# Altium schematic sheet [09] - AFE.SchDoc (part 1 of 3)
size A3; DocumentNumber: 10; SheetNumber: 10; SheetTotal: 12
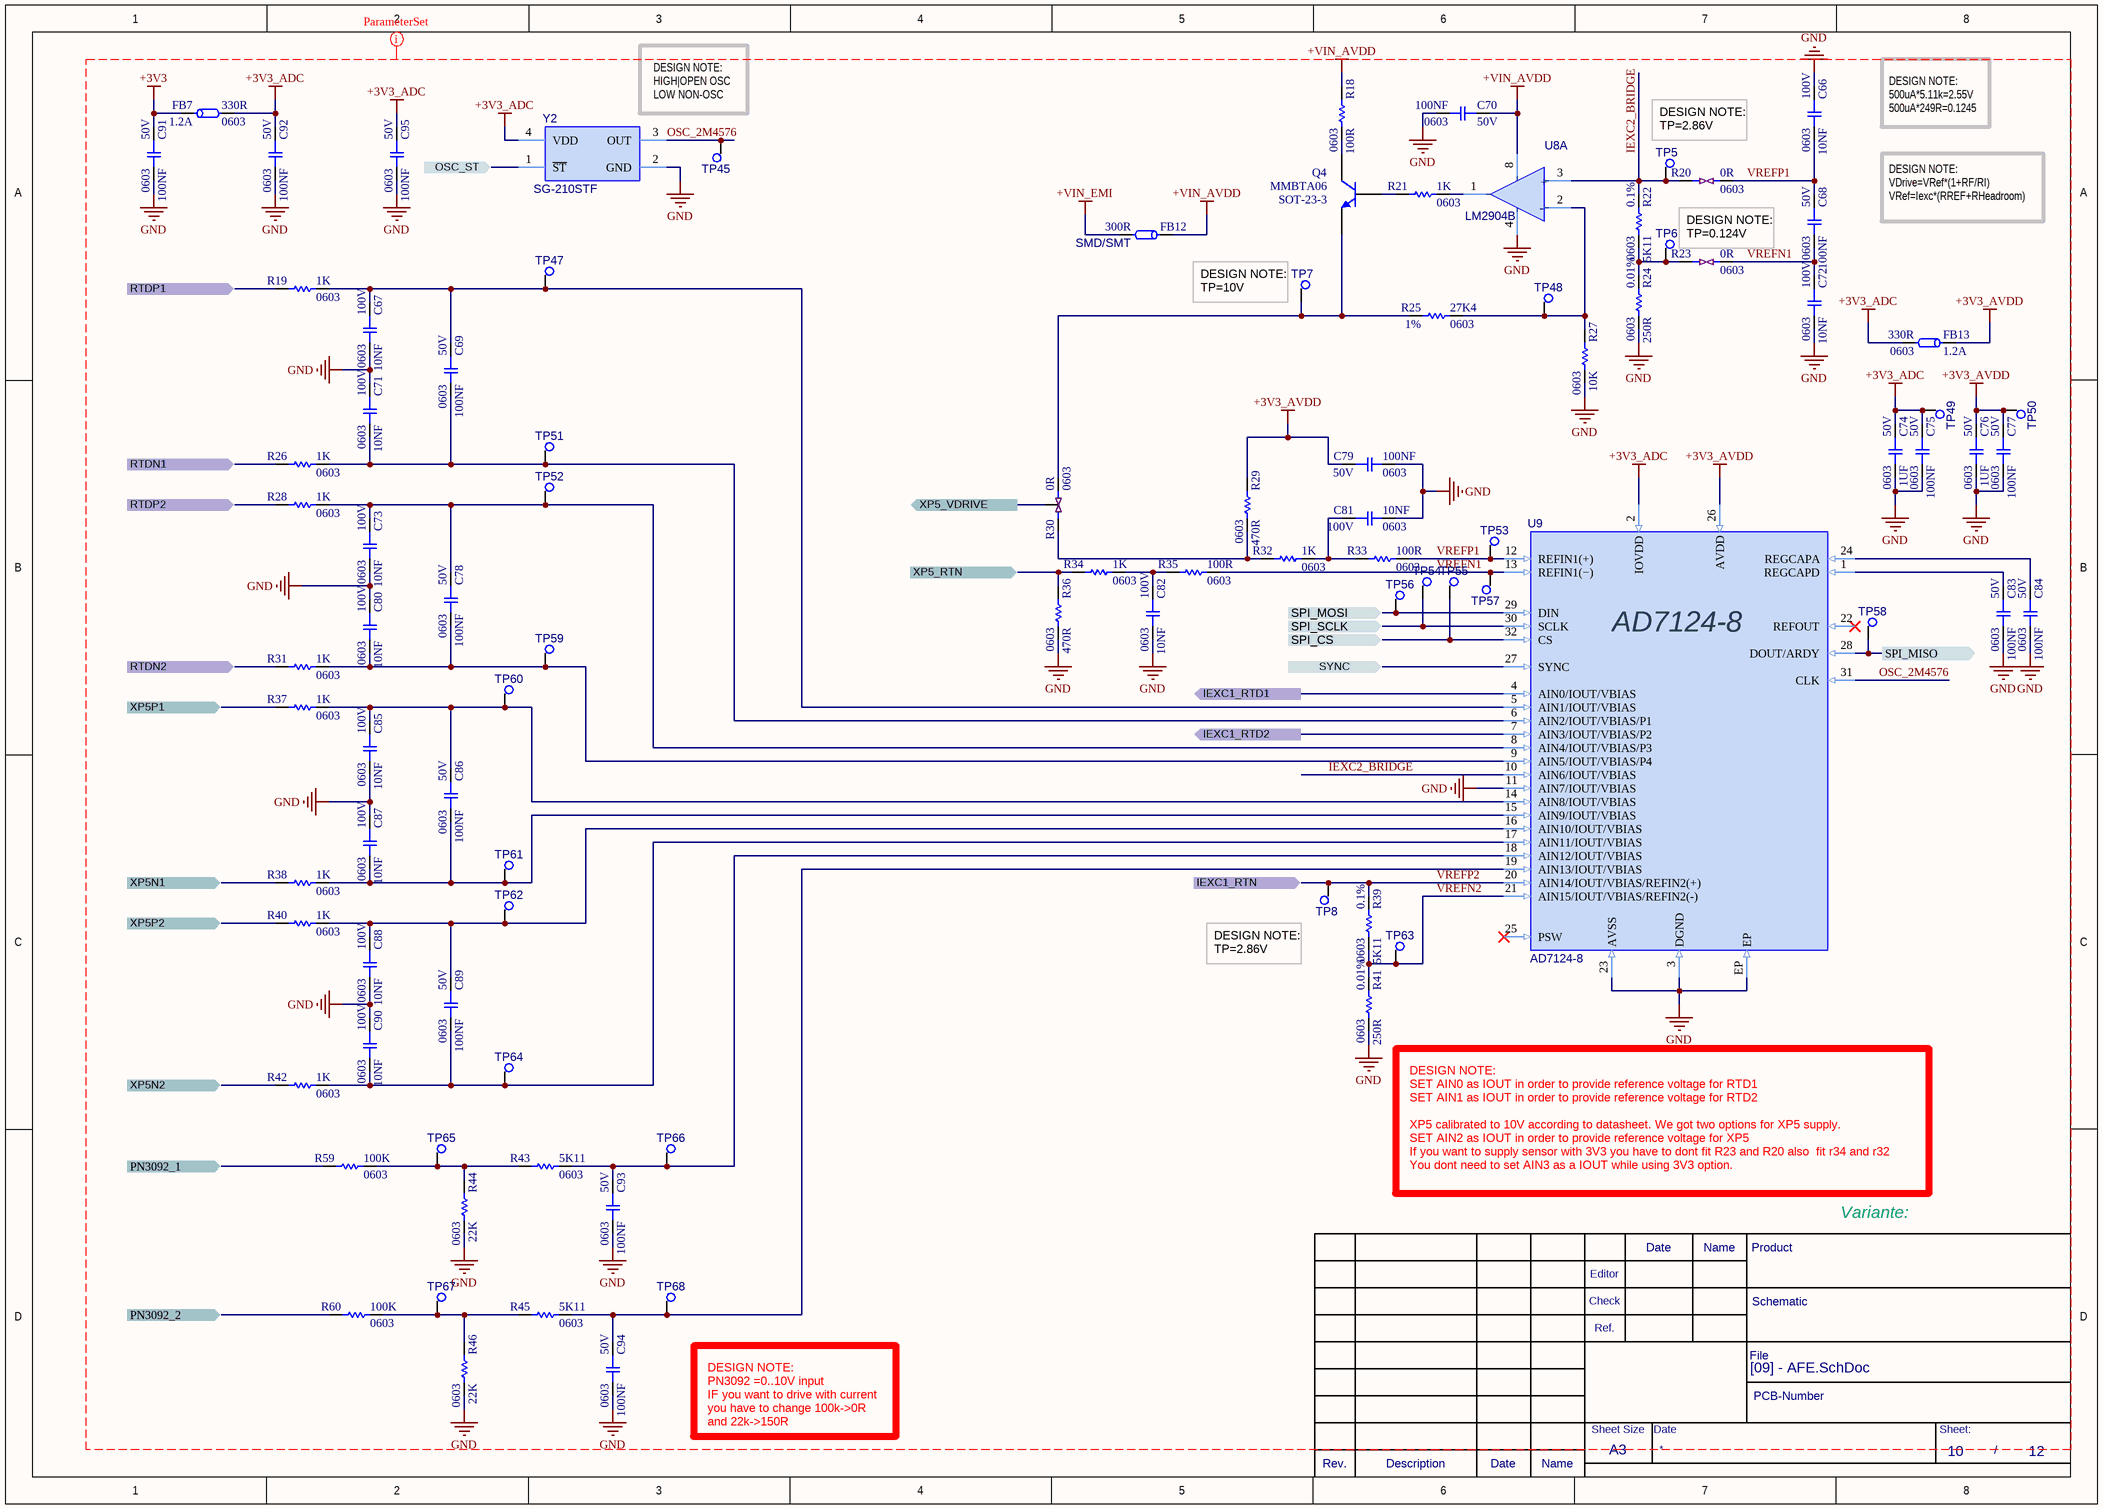
[diagram p0: [09] - AFE.SchDoc]

## Parts
C66  10NF  Voltage Rating: 100V  Case Code (Imperial): 0603  [C-0603]
C67  10NF  Voltage Rating: 100V  Case Code (Imperial): 0603  [C-0603]
C68  100NF  Voltage Rating: 50V  Case/Package: 0603  [C-0603]
C69  100NF  Voltage Rating: 50V  Case/Package: 0603  [C-0603]
C70  100NF  Voltage Rating: 50V  Case Code (Imperial): 0603  [C-0603]
C71  10NF  Voltage Rating: 100V  Case Code (Imperial): 0603  [C-0603]
C72  10NF  Voltage Rating: 100V  Case Code (Imperial): 0603  [C-0603]
C73  10NF  Voltage Rating: 100V  Case Code (Imperial): 0603  [C-0603]
C74  1UF  Voltage Rating: 50V  Case/Package: 0603  [C-0603]
C75  100NF  Voltage Rating: 50V  Case/Package: 0603  [C-0603]
C76  1UF  Voltage Rating: 50V  Case/Package: 0603  [C-0603]
C77  100NF  Voltage Rating: 50V  Case/Package: 0603  [C-0603]
C78  100NF  Voltage Rating: 50V  Case/Package: 0603  [C-0603]
C79  100NF  Voltage Rating: 50V  Case/Package: 0603  [C-0603]
C80  10NF  Voltage Rating: 100V  Case Code (Imperial): 0603  [C-0603]
C81  10NF  Voltage Rating: 100V  Case Code (Imperial): 0603  [C-0603]
C82  10NF  Voltage Rating: 100V  Case Code (Imperial): 0603  [C-0603]
C83  100NF  Voltage Rating: 50V  Case/Package: 0603  [C-0603]
C84  100NF  Voltage Rating: 50V  Case/Package: 0603  [C-0603]
C85  10NF  Voltage Rating: 100V  Case Code (Imperial): 0603  [C-0603]
C86  100NF  Voltage Rating: 50V  Case/Package: 0603  [C-0603]
C87  10NF  Voltage Rating: 100V  Case Code (Imperial): 0603  [C-0603]
C88  10NF  Voltage Rating: 100V  Case Code (Imperial): 0603  [C-0603]
C89  100NF  Voltage Rating: 50V  Case/Package: 0603  [C-0603]
C90  10NF  Voltage Rating: 100V  Case Code (Imperial): 0603  [C-0603]
C91  100NF  Voltage Rating: 50V  Case Code (Imperial): 0603  [C-0603]
C92  100NF  Voltage Rating: 50V  Case Code (Imperial): 0603  [C-0603]
C93  100NF  Voltage Rating: 50V  Case Code (Imperial): 0603  [C-0603]
C94  100NF  Voltage Rating: 50V  Case Code (Imperial): 0603  [C-0603]
C95  100NF  Voltage Rating: 50V  Case Code (Imperial): 0603  [C-0603]
FB7  330R  Case/Package: 0603  DC Current: 1.2A  [FB-0603]
FB12  300R  Case/Package: SMD/SMT  [FB-1206]
FB13  330R  Case/Package: 0603  DC Current: 1.2A  [FB-0603]
Q4  MMBTA06  Case/Package: SOT-23-3  [SOT23-3]
R18  100R  Case Code (Imperial): 0603  [R-0603]
R19  1K  Case Code (Imperial): 0603  [R-0603]
R20  0R  Case Code (Imperial): 0603  [JMP-0603]
R21  1K  Case Code (Imperial): 0603  [R-0603]
R22  5K11  Tolerance: 0.1%  Case/Package: 0603  [R-0603]
R23  0R  Case Code (Imperial): 0603  [JMP-0603]
R24  250R  Tolerance: 0.01%  Case/Package: 0603  [R-0603]
R25  27K4  Tolerance: 1%  Case/Package: 0603  [R-0603]
R26  1K  Case Code (Imperial): 0603  [R-0603]
R27  10K  Case Code (Imperial): 0603  [R-0603]
R28  1K  Case Code (Imperial): 0603  [R-0603]
R29  470R  Case Code (Imperial): 0603  [R-0603]
R30  0R  Case Code (Imperial): 0603  [R-0603 - 3 Pad]
R31  1K  Case Code (Imperial): 0603  [R-0603]
R32  1K  Case Code (Imperial): 0603  [R-0603]
R33  100R  Case Code (Imperial): 0603  [R-0603]
R34  1K  Case Code (Imperial): 0603  [R-0603]
R35  100R  Case Code (Imperial): 0603  [R-0603]
R36  470R  Case Code (Imperial): 0603  [R-0603]
R37  1K  Case Code (Imperial): 0603  [R-0603]
R38  1K  Case Code (Imperial): 0603  [R-0603]
R39  5K11  Tolerance: 0.1%  Case/Package: 0603  [R-0603]
R40  1K  Case Code (Imperial): 0603  [R-0603]
R41  250R  Tolerance: 0.01%  Case/Package: 0603  [R-0603]
R42  1K  Case Code (Imperial): 0603  [R-0603]
R43  5K11  Case Code (Imperial): 0603  [R-0603]
R44  22K  Case Code (Imperial): 0603  [R-0603]
R45  5K11  Case Code (Imperial): 0603  [R-0603]
R46  22K  Case Code (Imperial): 0603  [R-0603]
R59  100K  Case Code (Imperial): 0603  [R-0603]
R60  100K  Case Code (Imperial): 0603  [R-0603]
TP5  MECH-TESTPOINT  [MECH-TESTPOINT]  (value not drawn)  (no BOM)
TP6  MECH-TESTPOINT  [MECH-TESTPOINT]  (value not drawn)  (no BOM)
TP7  MECH-TESTPOINT  [MECH-TESTPOINT]  (value not drawn)  (no BOM)
TP8  MECH-TESTPOINT  [MECH-TESTPOINT]  (value not drawn)  (no BOM)
TP45  MECH-TESTPOINT  [MECH-TESTPOINT]  (value not drawn)  (no BOM)
TP47  MECH-TESTPOINT  [MECH-TESTPOINT]  (value not drawn)  (no BOM)
TP48  MECH-TESTPOINT  [MECH-TESTPOINT]  (value not drawn)  (no BOM)
TP49  MECH-TESTPOINT  [MECH-TESTPOINT]  (value not drawn)  (no BOM)
TP50  MECH-TESTPOINT  [MECH-TESTPOINT]  (value not drawn)  (no BOM)
TP51  MECH-TESTPOINT  [MECH-TESTPOINT]  (value not drawn)  (no BOM)
TP52  MECH-TESTPOINT  [MECH-TESTPOINT]  (value not drawn)  (no BOM)
TP53  MECH-TESTPOINT  [MECH-TESTPOINT]  (value not drawn)  (no BOM)
TP54  MECH-TESTPOINT  [MECH-TESTPOINT]  (value not drawn)  (no BOM)
TP55  MECH-TESTPOINT  [MECH-TESTPOINT]  (value not drawn)  (no BOM)
TP56  MECH-TESTPOINT  [MECH-TESTPOINT]  (value not drawn)  (no BOM)
TP57  MECH-TESTPOINT  [MECH-TESTPOINT]  (value not drawn)  (no BOM)
TP58  MECH-TESTPOINT  [MECH-TESTPOINT]  (value not drawn)  (no BOM)
TP59  MECH-TESTPOINT  [MECH-TESTPOINT]  (value not drawn)  (no BOM)
TP60  MECH-TESTPOINT  [MECH-TESTPOINT]  (value not drawn)  (no BOM)
TP61  MECH-TESTPOINT  [MECH-TESTPOINT]  (value not drawn)  (no BOM)
TP62  MECH-TESTPOINT  [MECH-TESTPOINT]  (value not drawn)  (no BOM)
TP63  MECH-TESTPOINT  [MECH-TESTPOINT]  (value not drawn)  (no BOM)
TP64  MECH-TESTPOINT  [MECH-TESTPOINT]  (value not drawn)  (no BOM)
TP65  MECH-TESTPOINT  [MECH-TESTPOINT]  (value not drawn)  (no BOM)
TP66  MECH-TESTPOINT  [MECH-TESTPOINT]  (value not drawn)  (no BOM)
TP67  MECH-TESTPOINT  [MECH-TESTPOINT]  (value not drawn)  (no BOM)
TP68  MECH-TESTPOINT  [MECH-TESTPOINT]  (value not drawn)  (no BOM)
U8  LM2904B  [SOIC8-D0008A_M]  (part A of 2)
U9  AD7124-8  [32-WFQFN EP]
Y2  SG-210STF  [CRYSTAL-2.5X2]

## Ports
IEXC1_RTD1 (out), IEXC1_RTD2 (out), IEXC1_RTN (in), OSC_ST (in), PN3092_1 (in), PN3092_2 (in), RTDN1 (in), RTDN2 (in), RTDP1 (in), RTDP2 (in), SPI_CS (in), SPI_MISO (out), SPI_MOSI (in), SPI_SCLK (in), SYNC (in), XP5_RTN (in), XP5_VDRIVE (out), XP5N1 (in), XP5N2 (in), XP5P1 (in), XP5P2 (in)

## Nets
+3V3: C91.1 FB7.1
+3V3_ADC: C74.1 C75.1 C92.1 C95.1 FB7.2 FB13.2 TP49.1 U9.2(IOVDD) Y2.4(VDD)
+3V3_AVDD: C76.1 C77.1 C79.1 FB13.1 R29.1 TP50.1 U9.26(AVDD)
+VIN_AVDD: C70.1 FB12.1 R18.1 U8.8(V+)
+VIN_EMI: FB12.2
GND: C66.1 C67.2 C70.2 C71.1 C72.2 C73.2 C74.2 C75.2 C76.2 C77.2 C79.2 C80.1 C81.2 C82.2 C83.2 C84.2 C85.2 C87.1 C88.2 C90.1 C91.2 C92.2 C93.2 C94.2 C95.2 R24.2 R27.2 R36.2 R41.2 R44.2 R46.2 U8.4(V-) U9.3(DGND) U9.11(AIN7/IOUT/VBIAS) U9.23(AVSS) U9.EP Y2.2(GND)
IEXC1_RTD1: U9.4(AIN0/IOUT/VBIAS) ; port IEXC1_RTD1
IEXC1_RTD2: U9.7(AIN3/IOUT/VBIAS/P2) ; port IEXC1_RTD2
IEXC2_BRIDGE: R20.1 R22.1 TP5.1 U8.3(IN1+) U9.10(AIN6/IOUT/VBIAS)
OSC_2M4576: TP45.1 U9.31(CLK) Y2.3(OUT)
OSC_ST: Y2.1(~{ST}) ; port OSC_ST
PN3092_1: R59.1 ; port PN3092_1
PN3092_2: R60.1 ; port PN3092_2
RTDN1: R26.1 ; port RTDN1
RTDN2: R31.1 ; port RTDN2
RTDP1: R19.1 ; port RTDP1
RTDP2: R28.1 ; port RTDP2
SPI_CS: TP55.1 U9.32(CS) ; port SPI_CS
SPI_MISO: TP58.1 U9.28(DOUT/ARDY) ; port SPI_MISO
SPI_MOSI: TP56.1 U9.29(DIN) ; port SPI_MOSI
SPI_SCLK: TP54.1 U9.30(SCLK) ; port SPI_SCLK
SYNC: U9.27(SYNC) ; port SYNC
VREFN1: C68.2 C72.1 R23.2 R35.2 TP57.1 U9.13(REFIN1(−))
VREFN2: R39.2 R41.1 TP63.1 U9.21(AIN15/IOUT/VBIAS/REFIN2(-))
VREFP1: C66.2 C68.1 R20.2 R33.2 TP53.1 U9.12(REFIN1(+))
VREFP2: R39.1 TP8.1 U9.20(AIN14/IOUT/VBIAS/REFIN2(+)) ; port IEXC1_RTN
XP5_RTN: R34.1 R36.1 ; port XP5_RTN
XP5_VDRIVE: R30.2 ; port XP5_VDRIVE
XP5N1: R38.1 ; port XP5N1
XP5N2: R42.1 ; port XP5N2
XP5P1: R37.1 ; port XP5P1
XP5P2: R40.1 ; port XP5P2
NetC67_1: C67.1 C69.1 R19.2 TP47.1 U9.5(AIN1/IOUT/VBIAS)
NetC69_2: C69.2 C71.2 R26.2 TP51.1 U9.6(AIN2/IOUT/VBIAS/P1)
NetC73_1: C73.1 C78.1 R28.2 TP52.1 U9.8(AIN4/IOUT/VBIAS/P3)
NetC78_2: C78.2 C80.2 R31.2 TP59.1 U9.9(AIN5/IOUT/VBIAS/P4)
NetC81_1: C81.1 R32.2 R33.1
NetC82_1: C82.1 R34.2 R35.1
NetC83_1: C83.1 U9.1(REGCAPD)
NetC84_1: C84.1 U9.24(REGCAPA)
NetC85_1: C85.1 C86.1 R37.2 TP60.1 U9.14(AIN8/IOUT/VBIAS)
NetC86_2: C86.2 C87.2 R38.2 TP61.1 U9.15(AIN9/IOUT/VBIAS)
NetC88_1: C88.1 C89.1 R40.2 TP62.1 U9.16(AIN10/IOUT/VBIAS)
NetC89_2: C89.2 C90.2 R42.2 TP64.1 U9.17(AIN11/IOUT/VBIAS)
NetC93_1: C93.1 R43.2 TP66.1 U9.18(AIN12/IOUT/VBIAS)
NetC94_1: C94.1 R45.2 TP68.1 U9.19(AIN13/IOUT/VBIAS)
NetQ4_1: Q4.1 R21.1
NetQ4_2: Q4.2 R25.1 R30.3 TP7.1
NetQ4_3: Q4.3 R18.2
NetR21_2: R21.2 U8.1(OUT1)
NetR22_2: R22.2 R23.1 R24.1 TP6.1
NetR25_2: R25.2 R27.1 TP48.1 U8.2(IN1-)
NetR29_2: R29.2 R30.1 R32.1
NetR43_1: R43.1 R44.1 R59.2 TP65.1
NetR45_1: R45.1 R46.1 R60.2 TP67.1

Not connected (* = marked no-connect by the designer): U9 22(REFOUT)* 25(PSW)*

## Layout directives
net class ADC: +3V3, +3V3_ADC, +3V3_AVDD, +VIN_AVDD, +VIN_EMI, GND, IEXC2_BRIDGE, OSC_2M4576, VREFN1, VREFN2, VREFP1, VREFP2

## Notes on the sheet
- DESIGN NOTE:
  HIGH|OPEN OSC
  LOW NON-OSC
- DESIGN NOTE:
  500uA*5.11k=2.55V
  500uA*249R=0.1245
- DESIGN NOTE:
  TP=2.86V
- DESIGN NOTE:
  TP=0.124V
- DESIGN NOTE:
  VDrive=VRef*(1+RF/RI)
  VRef=Iexc*(RREF+RHeadroom)
- (near TP7) DESIGN NOTE:
  TP=10V
- (near U9) AD7124-8
- (near TP8) DESIGN NOTE:
  TP=2.86V
- DESIGN NOTE:
  SET AIN0 as IOUT in order to provide reference voltage for RTD1
  SET AIN1 as IOUT in order to provide reference voltage for RTD2
  XP5 calibrated to 10V according to datasheet. We got two options for XP5 supply.
  SET AIN2 as IOUT in order to provide reference voltage for XP5
  If you want to supply sensor with 3V3 you have to dont fit R23 and R20 also  fit r34 and r32
  You dont need to set AIN3 as a IOUT while using 3V3 option.
- DESIGN NOTE:
  PN3092 =0..10V input
  IF you want to drive with current you have to change 100k->0R and 22k->150R
- Date
- Name
- Product
- Variante:
- Editor
- Check
- Ref.
- Schematic
- File
- PCB-Number
- Rev.
- Description
- Sheet Size
- A3
- Sheet:
- /
- (in symbol IC-LM2904BQDRQ1, part A) +; -